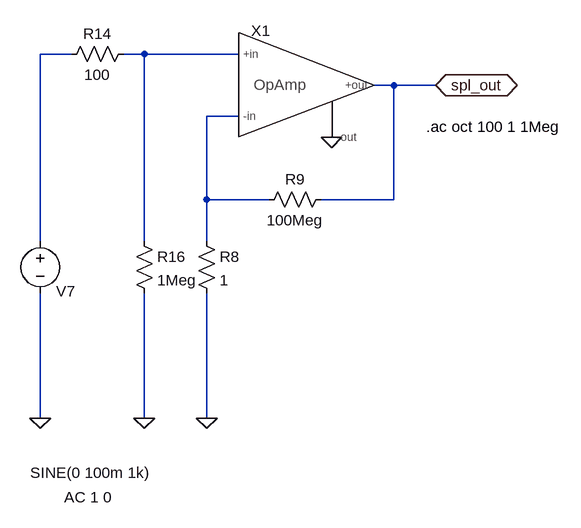
[diagram p0: schematic OpAmp_Test.asc]
OpAmp_Test.asc, the LTspice schematic file:
Version 4
SHEET 1 880 680
WIRE -15888 -4144 -15936 -4144
WIRE -15776 -4144 -15808 -4144
WIRE -15632 -4144 -15776 -4144
WIRE -15392 -4096 -15424 -4096
WIRE -15328 -4096 -15392 -4096
WIRE -15632 -4048 -15680 -4048
WIRE -15680 -3920 -15680 -4048
WIRE -15584 -3920 -15680 -3920
WIRE -15392 -3920 -15392 -4096
WIRE -15392 -3920 -15504 -3920
WIRE -15936 -3856 -15936 -4144
WIRE -15776 -3856 -15776 -4144
WIRE -15680 -3856 -15680 -3920
WIRE -15936 -3584 -15936 -3776
WIRE -15776 -3584 -15776 -3776
WIRE -15680 -3584 -15680 -3776
FLAG -15328 -4096 spl_out
IOPIN -15328 -4096 BiDir
FLAG -15776 -3584 0
FLAG -15936 -3584 0
FLAG -15680 -3584 0
FLAG -15488 -4016 0
SYMBOL res -15696 -3872 R0
SYMATTR InstName R8
SYMATTR Value 1
SYMBOL res -15488 -3936 R90
WINDOW 0 0 56 VBottom 0
WINDOW 3 32 56 VTop 0
SYMATTR InstName R9
SYMATTR Value 100Meg
SYMBOL res -15792 -4160 R90
WINDOW 0 0 56 VBottom 0
WINDOW 3 32 56 VTop 0
SYMATTR InstName R14
SYMATTR Value 100
SYMBOL res -15792 -3872 R0
SYMATTR InstName R16
SYMATTR Value 1Meg
SYMBOL voltage -15936 -3872 M0
WINDOW 123 -110 410 Left 0
WINDOW 39 0 0 Left 0
WINDOW 0 -54 93 Left 0
WINDOW 3 -170 372 Left 0
SYMATTR Value2 AC 1 0
SYMATTR InstName V7
SYMATTR Value SINE(0 100m 1k)
SYMBOL OpAmp -15536 -4096 R0
SYMATTR InstName X1
TEXT -15136 -4032 Right 0 !.ac oct 100 1 1Meg

The netlist it stands for:
* OpAmp_Test.asc
R8 N003 0 1
R9 spl_out N003 100Meg
R14 N002 N001 100
R16 N002 0 1Meg
V7 N001 0 SINE(0 100m 1k) AC 1 0
XX1 N003 0 spl_out N002 OpAmp  ; pins -in -out +out +in
.ac oct 100 1 1Meg
.backanno
.end